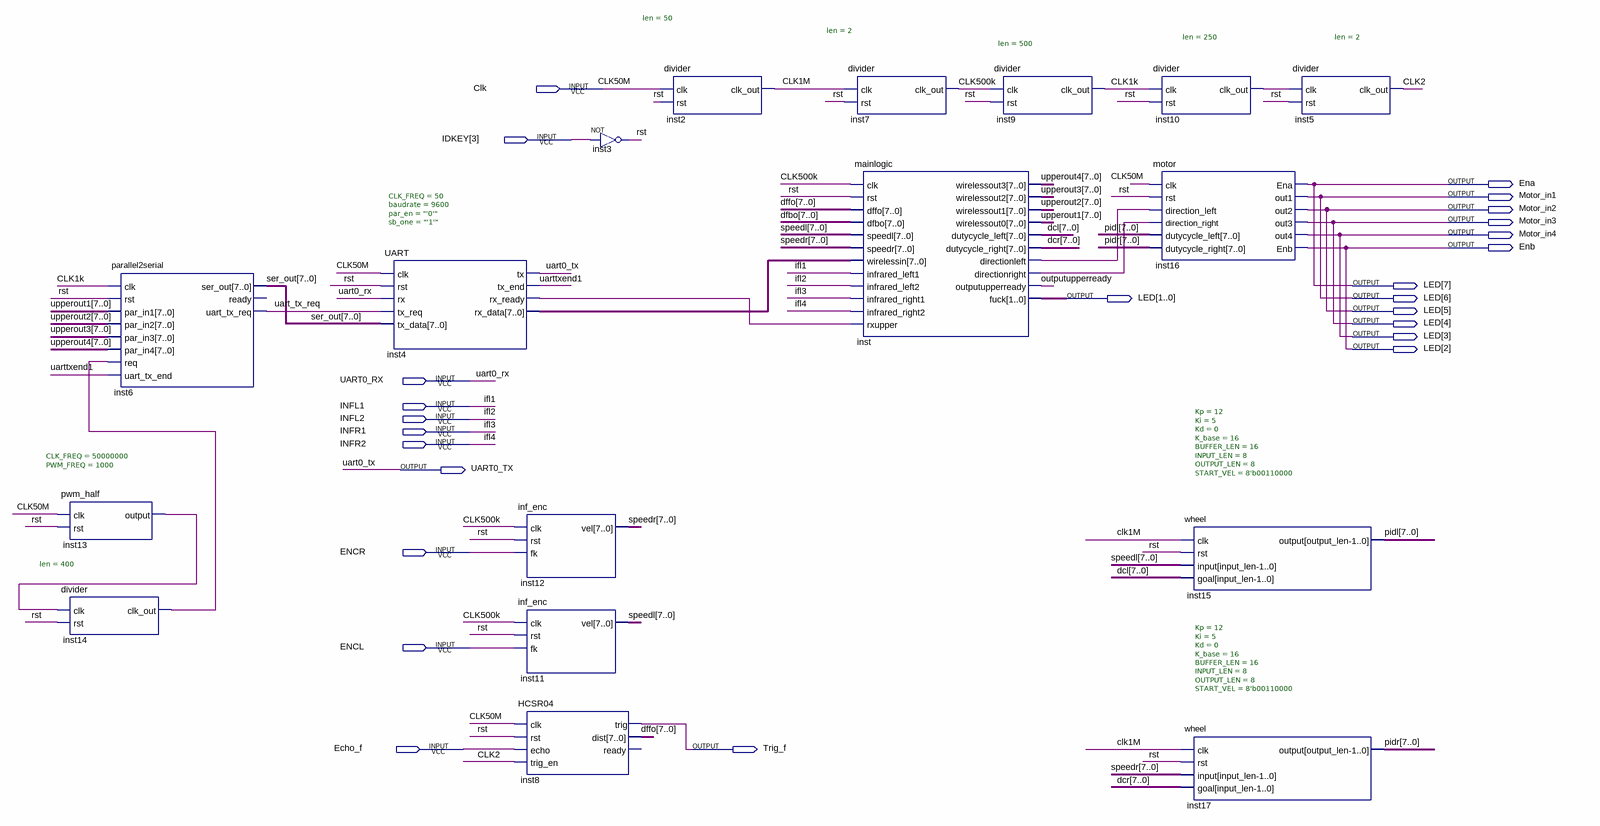
[diagram p0: schematic sheet]
// Quartus schematic Main_Logic.bdf as structural Verilog: 17 symbols, 25 pins
module Main_Logic (
  input  Clk,
  input  [3:3] IDKEY,
  input  UART0_RX,
  input  INFL1,
  input  INFL2,
  input  INFR1,
  input  INFR2,
  input  ENCR,
  input  ENCL,
  input  Echo_f,
  output Ena,
  output Motor_in1,
  output Motor_in2,
  output Motor_in3,
  output Motor_in4,
  output Enb,
  output [7:0] LED,
  output UART0_TX,
  output Trig_f
);

  wire CLK1k, CLK1M, CLK2, CLK500k, inst4_rx_ready, inst10_clk_out, inst13_output, inst14_clk_out,
       inst_directionleft, inst_directionright, outputupperready, rst, uart_tx_req, uarttxend1;
  wire [7:0] dcl, dcr, dfbo, dffo, inst4_rx_data, pidl, pidr, ser_out, speedl, speedr, upperout1, upperout2,
       upperout3, upperout4;

  pwm_half #(.CLK_FREQ(50000000), .PWM_FREQ(1000)) inst13 (.clk(Clk), .rst(rst), .\output (inst13_output));
  divider #(.len(400)) inst14 (.clk(inst13_output), .rst(rst), .clk_out(inst14_clk_out));
  parallel2serial inst6 (
    .clk(CLK1k), .rst(rst), .par_in1(upperout1), .par_in2(upperout2), .par_in3(upperout3),
    .par_in4(upperout4), .req(inst14_clk_out), .uart_tx_end(uarttxend1), .ser_out(ser_out),
    .uart_tx_req(uart_tx_req));  // open: ready
  UART #(.CLK_FREQ(50), .baudrate(9600), .par_en("'0'"), .sb_one("'1'")) inst4 (
    .clk(Clk), .rst(rst), .rx(UART0_RX), .tx_req(uart_tx_req), .tx_data(ser_out), .tx(UART0_TX),
    .tx_end(uarttxend1), .rx_ready(inst4_rx_ready), .rx_data(inst4_rx_data));
  inf_enc inst12 (.clk(CLK500k), .rst(rst), .fk(ENCR), .vel(speedr));
  inf_enc inst11 (.clk(CLK500k), .rst(rst), .fk(ENCL), .vel(speedl));
  HCSR04 inst8 (.clk(Clk), .rst(rst), .echo(Echo_f), .trig_en(CLK2), .trig(Trig_f), .\dist (dffo));  // open: ready
  not inst3 (rst, IDKEY[3]);
  divider #(.len(50)) inst2 (.clk(Clk), .rst(rst), .clk_out(CLK1M));
  divider #(.len(2)) inst7 (.clk(CLK1M), .rst(rst), .clk_out(CLK500k));
  mainlogic inst (
    .clk(CLK500k), .rst(rst), .dffo(dffo), .dfbo(dfbo), .speedl(speedl), .speedr(speedr),
    .wirelessin(inst4_rx_data), .infrared_left1(INFL1), .infrared_left2(INFL2), .infrared_right1(INFR1),
    .infrared_right2(INFR2), .rxupper(inst4_rx_ready), .wirelessout3(upperout4), .wirelessout2(upperout3),
    .wirelessout1(upperout2), .wirelessout0(upperout1), .dutycycle_left(dcl), .dutycycle_right(dcr),
    .directionleft(inst_directionleft), .directionright(inst_directionright),
    .outputupperready(outputupperready), .fuck(LED[1:0]));
  divider #(.len(500)) inst9 (.clk(CLK500k), .rst(rst), .clk_out(CLK1k));
  divider #(.len(250)) inst10 (.clk(CLK1k), .rst(rst), .clk_out(inst10_clk_out));
  motor inst16 (
    .clk(Clk), .rst(rst), .direction_left(inst_directionleft), .direction_right(inst_directionright),
    .dutycycle_left(pidl), .dutycycle_right(pidr), .Ena(Ena), .out1(LED[6]), .out2(LED[5]), .out3(LED[4]),
    .out4(LED[3]), .Enb(Enb));
  wheel #(.Kp(12), .Ki(5), .Kd(0), .K_base(16), .BUFFER_LEN(16), .INPUT_LEN(8), .OUTPUT_LEN(8), .START_VEL(8'b00110000)) inst15 (
    .clk(CLK1M), .rst(rst), .\input (speedl), .goal(dcl), .\output (pidl));
  wheel #(.Kp(12), .Ki(5), .Kd(0), .K_base(16), .BUFFER_LEN(16), .INPUT_LEN(8), .OUTPUT_LEN(8), .START_VEL(8'b00110000)) inst17 (
    .clk(CLK1M), .rst(rst), .\input (speedr), .goal(dcr), .\output (pidr));
  divider #(.len(2)) inst5 (.clk(inst10_clk_out), .rst(rst), .clk_out(CLK2));

  assign {LED[7], LED[2]} = {Ena, Enb};
  assign Motor_in1 = LED[6];
  assign Motor_in2 = LED[5];
  assign Motor_in3 = LED[4];
  assign Motor_in4 = LED[3];

  // Other names for the same wires on the sheet: CLK50M = Clk; ifl1 = INFL1; ifl2 = INFL2; ifl3 = INFR1; ifl4 = INFR2
endmodule
